# EAGLE design ruralhack-board-r2 (EAGLE 6.6.0)
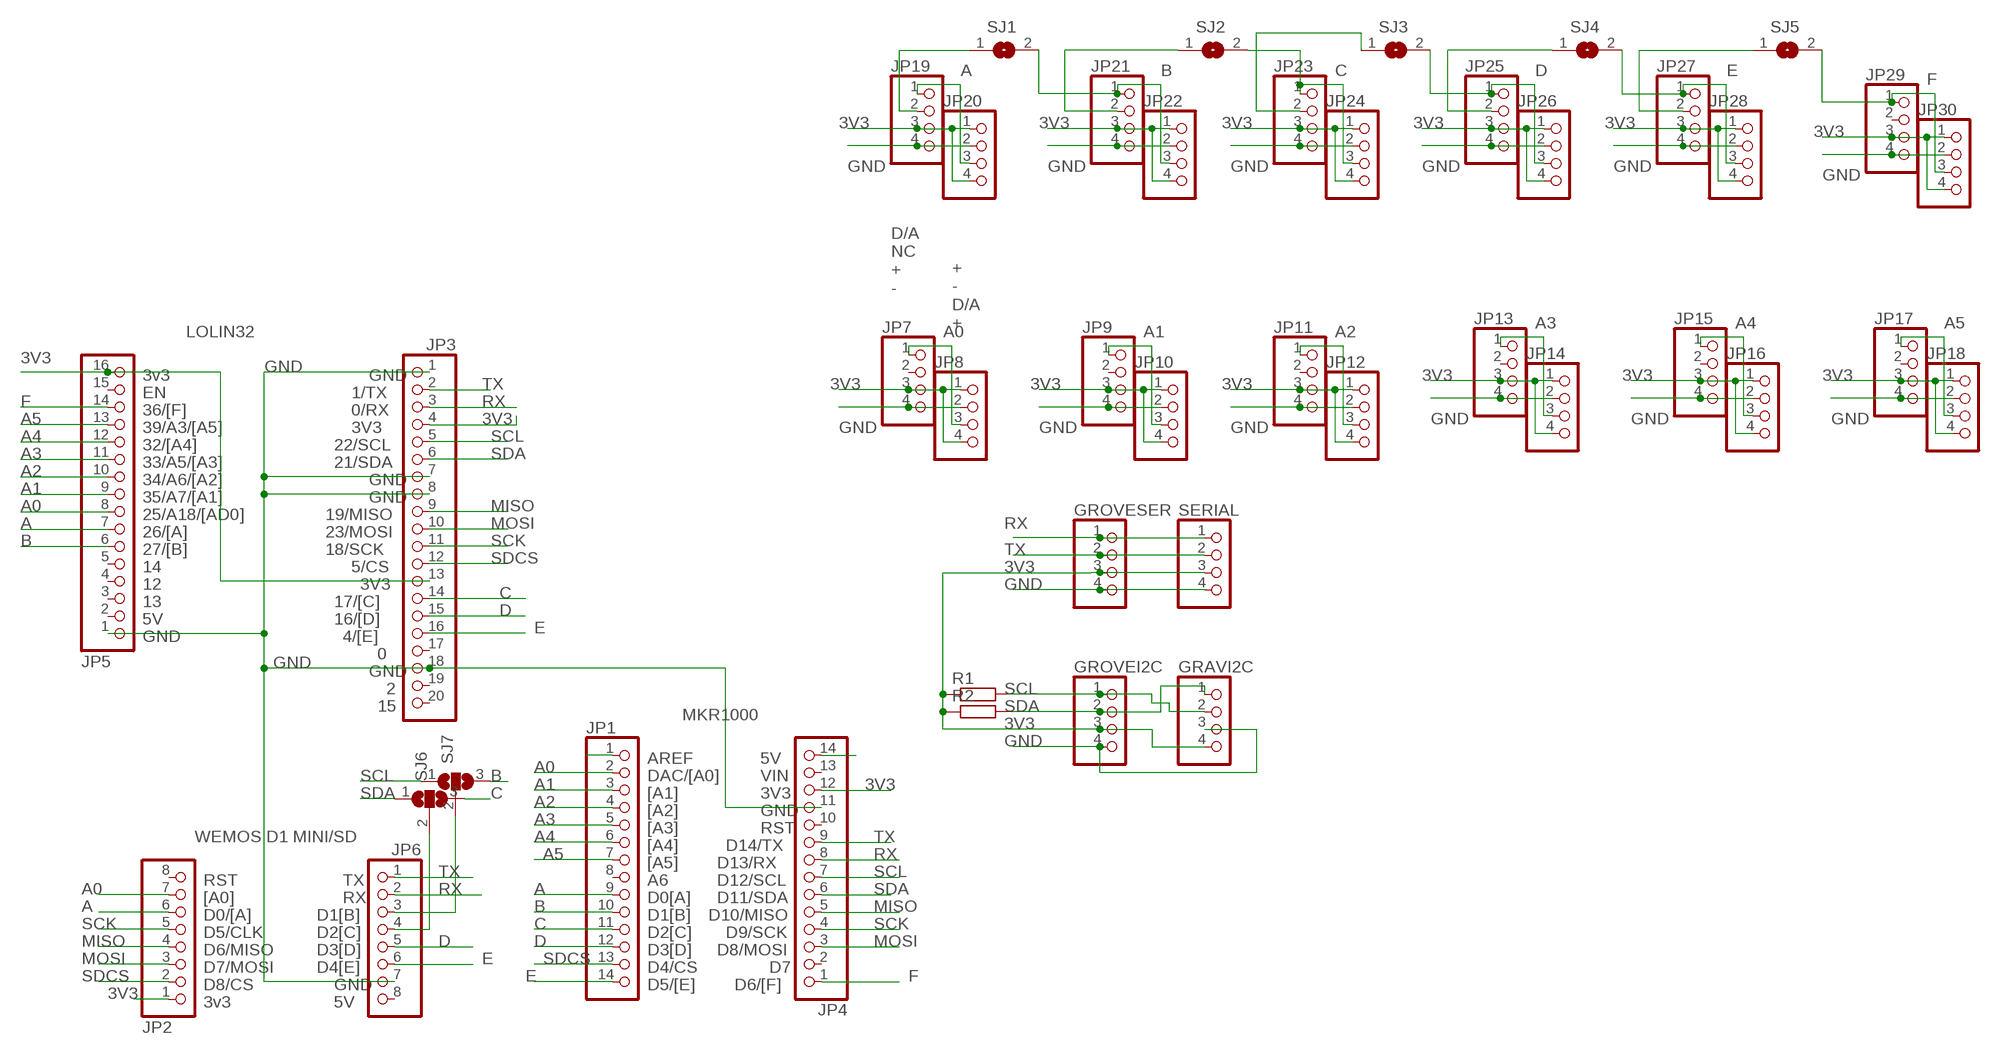
[diagram p0: schematic, sheet 1]

## Parts
GRAVI2C  PINHD-1X4  [1X04]
GROVEI2C  PINHD-1X4  [1X04]
GROVESER  PINHD-1X4  [1X04]
JP1  PINHD-1X14  [1X14]
JP2  PINHD-1X8  [1X08]
JP3  PINHD-1X20  [1X20]
JP4  PINHD-1X14  [1X14]
JP5  PINHD-1X16  [1X16]
JP6  PINHD-1X8  [1X08]
JP7  PINHD-1X4  [1X04]
JP8  PINHD-1X4  [1X04]
JP9  PINHD-1X4  [1X04]
JP10  PINHD-1X4  [1X04]
JP11  PINHD-1X4  [1X04]
JP12  PINHD-1X4  [1X04]
JP13  PINHD-1X4  [1X04]
JP14  PINHD-1X4  [1X04]
JP15  PINHD-1X4  [1X04]
JP16  PINHD-1X4  [1X04]
JP17  PINHD-1X4  [1X04]
JP18  PINHD-1X4  [1X04]
JP19  PINHD-1X4  [1X04]
JP20  PINHD-1X4  [1X04]
JP21  PINHD-1X4  [1X04]
JP22  PINHD-1X4  [1X04]
JP23  PINHD-1X4  [1X04]
JP24  PINHD-1X4  [1X04]
JP25  PINHD-1X4  [1X04]
JP26  PINHD-1X4  [1X04]
JP27  PINHD-1X4  [1X04]
JP28  PINHD-1X4  [1X04]
JP29  PINHD-1X4  [1X04]
JP30  PINHD-1X4  [1X04]
R1  R-EU_0204/7  [0204/7]
R2  R-EU_0204/7  [0204/7]
SERIAL  PINHD-1X4  [1X04]
SJ1  SJW  [SJW]
SJ2  SJW  [SJW]
SJ3  SJW  [SJW]
SJ4  SJW  [SJW]
SJ5  SJW  [SJW]
SJ6  SJ2WW  [SJ_2W]
SJ7  SJ2WW  [SJ_2W]

## Nets
3V3: GRAVI2C.4 GROVEI2C.3 GROVESER.3 JP2.1 JP3.4 JP3.13 JP4.12 JP5.16 JP7.3 JP8.1 JP8.4 JP9.3 JP10.1 JP10.4 JP11.3 JP12.1 JP12.4 JP13.3 JP14.1 JP14.4 JP15.3 JP16.1 JP16.4 JP17.3 JP18.1 JP18.4 JP19.3 JP20.1 JP20.4 JP21.3 JP22.1 JP22.4 JP23.3 JP24.1 JP24.4 JP25.3 JP26.1 JP26.4 JP27.3 JP28.1 JP28.4 JP29.3 JP30.1 JP30.4 R1.1 R2.1 SERIAL.3
A: JP1.9 JP2.6 JP5.7 JP19.1 JP20.3
A0: JP1.2 JP2.7 JP5.8 JP7.1 JP8.3
A1: JP1.3 JP5.9 JP9.1 JP10.3
A2: JP1.4 JP5.10 JP11.1 JP12.3
A3: JP1.5 JP5.11 JP13.1 JP14.3
A4: JP1.6 JP5.12 JP15.1 JP16.3
A5: JP1.7 JP5.13 JP17.1 JP18.3
B: JP1.10 JP5.6 JP21.1 JP22.3 SJ1.2 SJ7.3
C: JP1.11 JP3.14 JP23.1 JP24.3 SJ2.2 SJ6.3
D: JP1.12 JP3.15 JP6.5 JP25.1 JP26.3 SJ3.2
E: JP1.14 JP3.16 JP6.6 JP27.1 JP28.3 SJ4.2
F: JP4.1 JP5.14 JP29.1 JP30.3 SJ5.2
GND: GRAVI2C.3 GROVEI2C.4 GROVESER.4 JP3.1 JP3.7 JP3.8 JP3.18 JP4.11 JP5.1 JP6.7 JP7.4 JP8.2 JP9.4 JP10.2 JP11.4 JP12.2 JP13.4 JP14.2 JP15.4 JP16.2 JP17.4 JP18.2 JP19.4 JP20.2 JP21.4 JP22.2 JP23.4 JP24.2 JP25.4 JP26.2 JP27.4 JP28.2 JP29.4 JP30.2 SERIAL.4
MISO: JP2.4 JP3.9 JP4.5
MOSI: JP2.3 JP3.10 JP4.3
N$2: JP1.1
N$3: JP4.14
N$4: JP19.2 SJ1.1
N$6: JP21.2 SJ2.1
N$7: JP23.2 SJ3.1
N$8: JP25.2 SJ4.1
N$9: JP6.3 SJ7.2
N$10: JP27.2 SJ5.1
N$11: JP6.4 SJ6.2
RX: GROVESER.1 JP3.3 JP4.8 JP6.2 SERIAL.1
SCK: JP2.5 JP3.11 JP4.4
SCL: GRAVI2C.2 GROVEI2C.1 JP3.5 JP4.7 R1.2 SJ7.1
SDA: GRAVI2C.1 GROVEI2C.2 JP3.6 JP4.6 R2.2 SJ6.1
SDCS: JP1.13 JP2.2 JP3.12
TX: GROVESER.2 JP3.2 JP4.9 JP6.1 SERIAL.2
Unconnected: JP1.8 JP2.8 JP3.17 JP3.19 JP3.20 JP4.2 JP4.10 JP4.13 JP5.2 JP5.3 JP5.4 JP5.5 JP5.15 JP6.8 JP7.2 JP9.2 JP11.2 JP13.2 JP15.2 JP17.2 JP29.2

## Notes on the sheet
- D/A
  NC
  +
  -
- +
  -
  D/A
  +
- LOLIN32
- 3v3 | GND
- EN | 1/TX
- 36/[F] | 0/RX
- 39/A3/[A5] | 3V3
- 32/[A4] | 22/SCL
- 33/A5/[A3] | 21/SDA
- 34/A6/[A2] | GND
- 35/A7/[A1] | GND
- 25/A18/[AD0] | 19/MISO
- 26/[A] | 23/MOSI
- 27/[B] | 18/SCK
- 14 | 5/CS
- 12 | 3V3
- 13 | 17/[C]
- 5V | 16/[D]
- GND | 4/[E]
- 0
- GND
- 2
- 15
- MKR1000
- AREF | 5V
- DAC/[A0] | VIN
- [A1] | 3V3
- [A2] | GND
- [A3] | RST
- WEMOS D1 MINI/SD
- [A4] | D14/TX
- [A5] | D13/RX
- RST | TX | A6 | D12/SCL
- [A0] | RX | D0[A] | D11/SDA
- D0/[A] | D1[B] | D1[B] | D10/MISO
- D5/CLK | D2[C] | D2[C] | D9/SCK
- D6/MISO | D3[D] | D3[D] | D8/MOSI
- D7/MOSI | D4[E] | D4/CS | D7
- D8/CS | GND | D5/[E] | D6/[F]
- 3v3 | 5V

## Library data of the parts
GRAVI2C GROVEI2C GROVESER JP7-JP30 SERIAL = RepRapjr:PINHD-1X4: PIN HEADER
JP1 JP4 = pinhead-thin:PINHD-1X14: PIN HEADER
JP2 JP6 = pinhead-thin:PINHD-1X8: PIN HEADER
JP3 = pinhead-thin:PINHD-1X20: PIN HEADER
JP5 = pinhead-thin:PINHD-1X16: PIN HEADER
R1 R2 = rcl:R-EU_: RESISTOR, European symbol
SJ1-SJ5 = jumper:SJ: SMD solder JUMPER
SJ6 SJ7 = jumper:SJ2W: SMD solder JUMPER

## Board
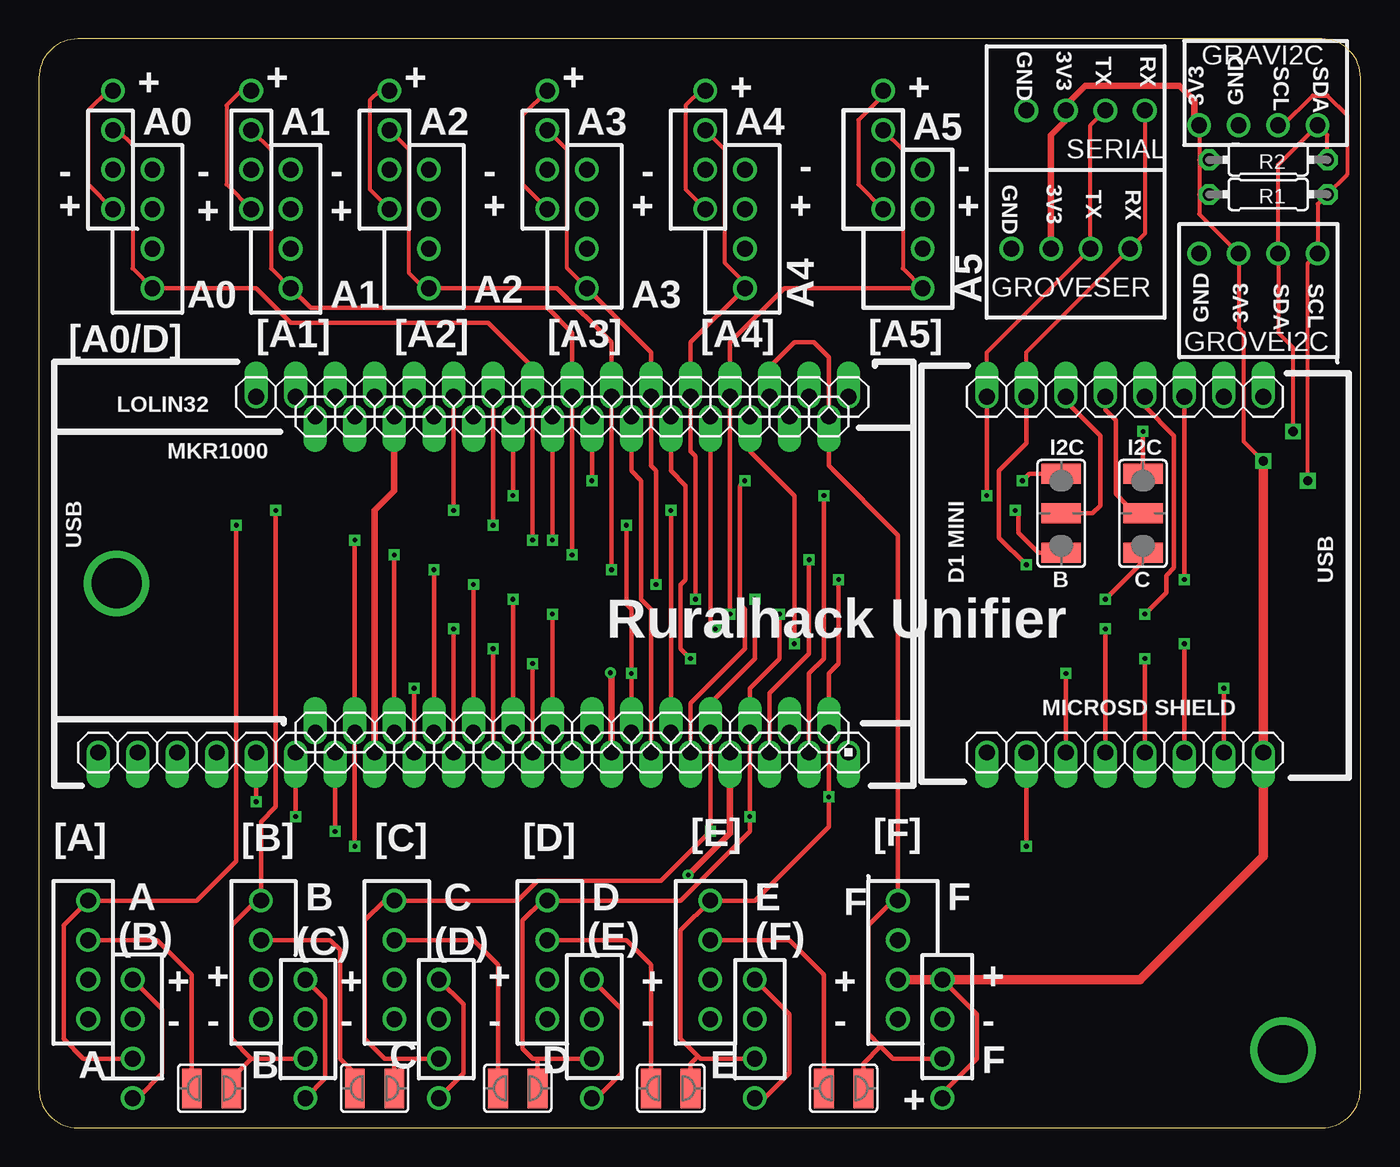
[diagram p1: board, top side]
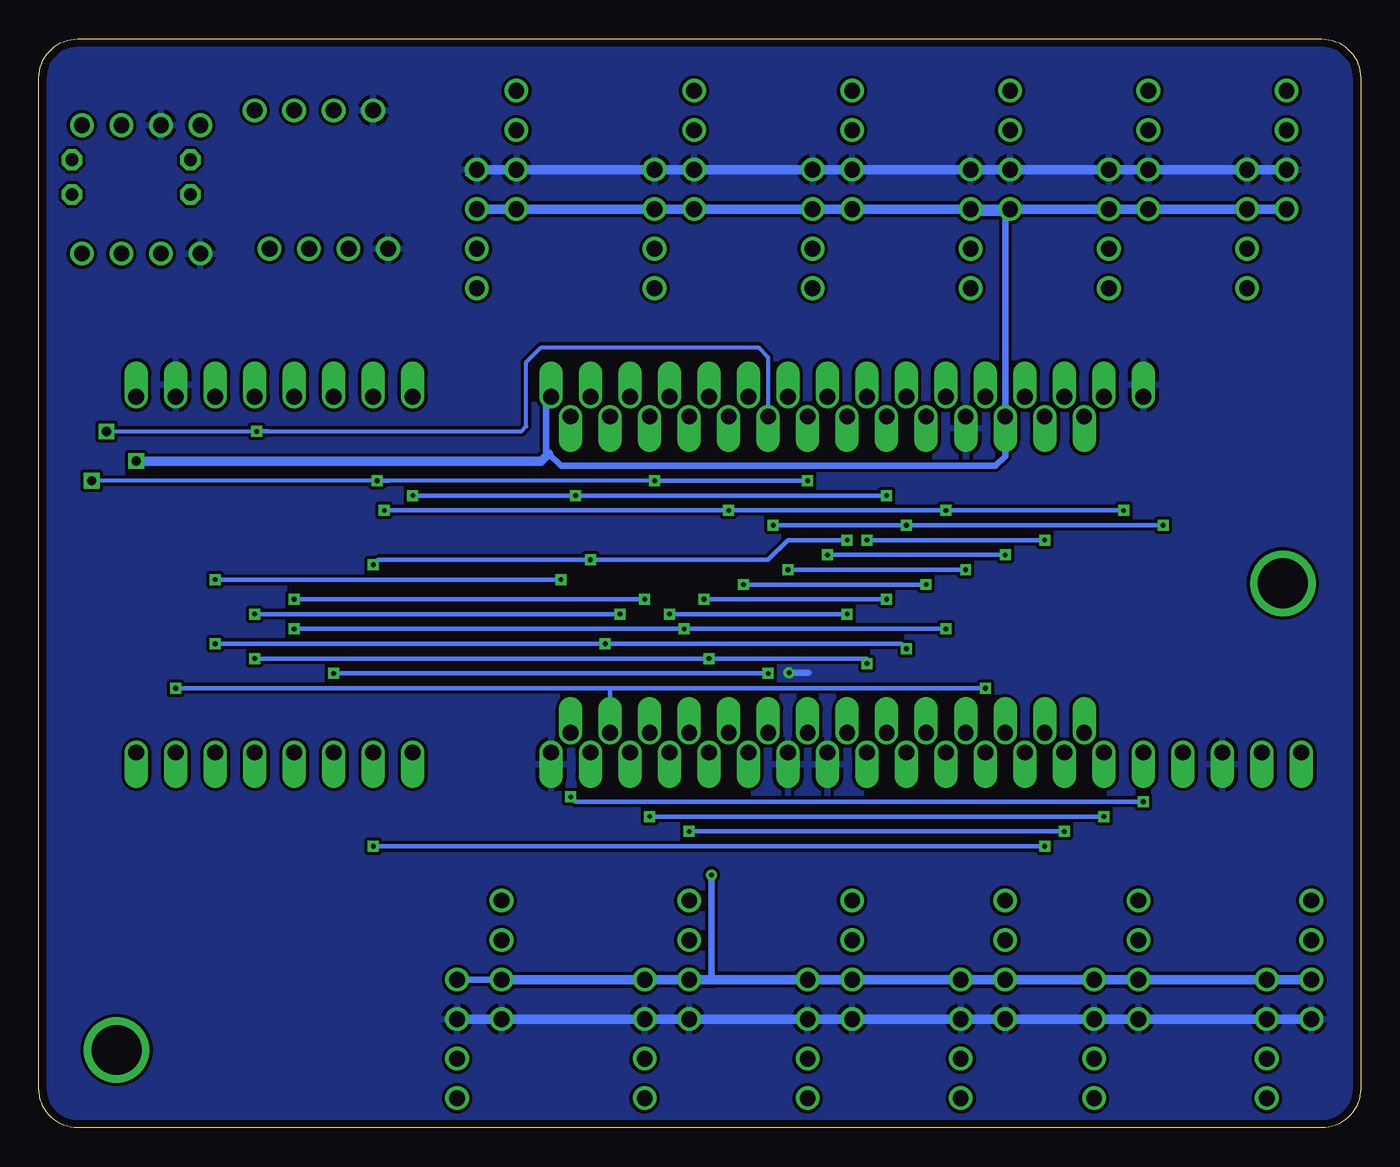
[diagram p2: board, bottom side, seen from below]

Size 85 x 70 mm. Coordinates in mm from the lower left corner, seen from the top.
Outline: 0,67.5 0,2.5 arc90 2.5,0 82.5,0 arc90 85,2.5 85,67.5 arc90 82.5,70 2.5,70 arc90 0,67.5
Copper layers (1*16): Top 0.035mm / dielectric 1.5mm / Bottom 0.035mm
Design rules "default *": minimum track width 10mil, minimum drill 0.3mm, track to track 8mil, track to pad 8mil, pad to pad 8mil, via to via 8mil, smd to smd 8mil, copper to edge 0.5mm, drill to drill 8mil, minimum pad ring 10mil, minimum via ring 8mil, stop-mask expansion 4mil, vias tented up to drill 0mil, thermal gap 10mil

### Footprints (pad centres in the part's own frame; a part is rotated, then mirrored left to right if it is on the bottom)
1X04 = drill 1.016: 1 -2.54,0; 2 0,0; 3 2.54,0; 4 5.08,0
1X14 = drill 1.016 offset: 1 -16.51,0; 2 -13.97,0; 3 -11.43,0; 4 -8.89,0; 5 -6.35,0; 6 -3.81,0; 7 -1.27,0; 8 1.27,0; 9 3.81,0; 10 6.35,0; 11 8.89,0; 12 11.43,0; 13 13.97,0; 14 16.51,0
1X08 = drill 1.016 offset: 1 -8.89,0; 2 -6.35,0; 3 -3.81,0; 4 -1.27,0; 5 1.27,0; 6 3.81,0; 7 6.35,0; 8 8.89,0
1X20 = drill 1.016 offset: 1 -24.13,0; 2 -21.59,0; 3 -19.05,0; 4 -16.51,0; 5 -13.97,0; 6 -11.43,0; 7 -8.89,0; 8 -6.35,0; 9 -3.81,0; 10 -1.27,0; 11 1.27,0; 12 3.81,0; 13 6.35,0; 14 8.89,0; 15 11.43,0; 16 13.97,0; 17 16.51,0; 18 19.05,0; 19 21.59,0; 20 24.13,0
1X16 = drill 1.016 offset: 1 -19.05,0; 2 -16.51,0; 3 -13.97,0; 4 -11.43,0; 5 -8.89,0; 6 -6.35,0; 7 -3.81,0; 8 -1.27,0; 9 1.27,0; 10 3.81,0; 11 6.35,0; 12 8.89,0; 13 11.43,0; 14 13.97,0; 15 16.51,0; 16 19.05,0
0204/7 = drill 0.813 octagon: 1 -3.81,0; 2 3.81,0
SJW = smd 1.27 x 2.54: 1 -1.27,0; 2 1.27,0
SJ_2W = smd 1.27 x 2.54: 1 -2.54,0; 2 0,0; 3 2.54,0

### Placement (x,y rotation side)
GRAVI2C  79.69,64.45 180 top
GROVEI2C  79.69,56.2 180 top
GROVESER  67.63,56.52 180 top
JP1  34.29,25.4 0 top
JP2  69.85,24.13 180 top
JP3  27.94,24.13 180 top
JP4  34.29,45.72 180 top
JP5  33.02,46.99 0 top
JP6  69.85,46.99 0 top
JP7  7.3,56.52 90 top
JP8  4.76,61.59 90 top
JP9  16.19,56.52 90 top
JP10  13.65,61.59 90 top
JP11  25.08,56.52 90 top
JP12  22.54,61.59 90 top
JP13  35.24,56.52 90 top
JP14  32.7,61.59 90 top
JP15  45.4,56.52 90 top
JP16  42.86,61.59 90 top
JP17  56.83,56.52 90 top
JP18  54.29,61.59 90 top
JP19  3.17,12.06 270 top
JP20  6.03,6.99 270 top
JP21  14.29,12.06 270 top
JP22  17.14,6.99 270 top
JP23  22.86,12.06 270 top
JP24  25.72,6.99 270 top
JP25  32.7,12.06 270 top
JP26  35.56,6.99 270 top
JP27  43.18,12.06 270 top
JP28  46.04,6.99 270 top
JP29  55.24,12.06 270 top
JP30  58.1,6.99 270 top
R1  79.06,60.01 0 top
R2  79.06,62.23 0 top
SERIAL  68.58,65.41 180 top
SJ1  11.11,2.54 0 top
SJ2  21.59,2.54 0 top
SJ3  30.8,2.54 0 top
SJ4  40.64,2.54 0 top
SJ5  51.75,2.54 0 top
SJ6  71,39.5 270 top
SJ7  65.75,39.5 270 top

### Tracks (layer width: path | path; a pad name or v marks a point on that pad's centre or on a via)
3V3  (via drill 0.3, 0.6)
  Top 0.254: JP14.4 31.11,65.09 31.11,60.64 JP14.1 | JP16.4 42.55,66.67 41.59,65.72 41.59,60.33 JP16.1 | JP18.4 54.29,66.36 52.7,64.77 52.7,60.64 JP18.1 | JP12.4 21.91,66.67 21.27,66.04 21.27,60.33 JP12.1 | JP10.4 13.02,66.67 12.06,65.72 12.06,60.64 JP10.1 | JP8.4 4.45,66.67 3.17,65.41 3.17,60.64 JP8.1 | GRAVI2C.4 74.61,62.23 | 74.61,62.23 74.61,60.01 | 74.61,60.01 74.61,58.74 GROVEI2C.3 77.15,51.44 77.47,51.12 77.47,44.13 v78.74,42.86 | R1.1 74.61,60.01 | R2.1 74.61,62.23
  Top 0.305: JP20.4 6.35,1.91 7.94,3.49 7.94,7.62 JP20.1 | JP22.4 18.41,3.17 18.41,8.26 JP22.1 | JP24.4 27.3,3.49 27.3,7.94 JP24.1 | JP26.4 35.88,1.91 37.47,3.49 37.47,7.62 JP26.1 | JP28.4 46.67,1.91 48.26,3.49 48.26,7.3 JP28.1 | JP30.4 58.1,2.22 60.33,4.45 60.33,7.3 JP30.1
  Top 0.406: JP3.13 21.59,39.69 22.86,40.96 JP4.12 | GROVESER.3 65.09,63.82 66.04,64.77 SERIAL.3 66.04,65.72 67.31,66.99 73.34,66.99 74.3,66.04 74.3,64.77 GRAVI2C.4 | JP3.4 44.45,18.95 v41.75,16.25
  Top 0.61: v78.74,42.86 JP2.1 78.74,17.46 70.8,9.53 JP29.3
  Bottom 0.254: 22.86,58.74 24.77,58.74 JP11.3 JP13.3 35.56,58.74
  Bottom 0.406: JP12.1 22.86,58.74 JP4.12 22.86,43.18 23.5,42.55 51.44,42.55 52.23,43.34 52.39,43.5 52.39,46.67 JP5.16 | JP29.3 JP30.1 | v41.75,16.25 41.75,9.78 41.5,9.53
  Bottom 0.61: JP29.3 JP28.1 JP27.3 41.5,9.53 JP26.1 JP25.3 JP24.1 JP23.3 JP22.1 JP21.3 JP20.1 JP19.3 | JP8.1 JP7.3 JP10.1 JP9.3 JP12.1 JP11.3 JP14.1 JP13.3 JP16.1 JP15.3 JP18.1 JP17.3 | v78.74,42.86 52.7,42.86 52.23,43.34
A  (via drill 0.3)
  Top 0.305: JP1.9 v38.1,29.21 38.1,33.34 37.78,33.66 v37.78,38.73 | v29.21,38.73 JP5.7 | JP2.6 v66.04,29.21 | v12.7,38.73 12.7,17.14 10.16,14.61 JP19.1 1.59,13.02 1.59,5.71 2.86,4.45 JP20.3
  Bottom 0.305: v37.78,38.73 v29.21,38.73 v12.7,38.73 | v66.04,29.21 v38.1,29.21
A0  (via drill 0.3)
  Top 0.254: JP8.3 5.08,64.14 6.03,63.18 6.03,55.24 JP7.1
  Top 0.305: v20.32,37.78 JP1.2 v20.32,18.1 | v31.75,37.78 JP5.8 31.75,48.9 28.89,51.75 16.19,51.75 13.97,53.98 JP7.1 | JP2.7 v63.5,18.1
  Bottom 0.305: v20.32,37.78 v31.75,37.78 | v63.5,18.1 v20.32,18.1
A1  (via drill 0.3)
  Top 0.254: JP10.3 14.92,62.87 14.92,55.24 JP9.1
  Top 0.305: v34.29,36.83 JP5.9 34.29,51.12 32.7,52.7 17.46,52.7 JP9.1 | v22.86,36.83 JP1.3
  Bottom 0.305: v34.29,36.83 v22.86,36.83
A2  (via drill 0.3)
  Top 0.254: JP11.1 24.77,53.98 23.81,54.93 23.81,62.87 JP12.3
  Top 0.305: JP1.4 v25.4,35.88 | v36.83,35.88 JP5.10 36.83,50.48 33.34,53.98 JP11.1
  Bottom 0.305: v25.4,35.88 v36.83,35.88
A3  (via drill 0.3)
  Top 0.254: JP13.1 33.97,55.24 33.97,62.87 JP14.3
  Top 0.305: JP1.5 v27.94,34.92 | v39.69,34.92 39.69,42.23 39.37,42.55 JP5.11 39.37,49.85 JP13.1
  Bottom 0.305: v27.94,34.92 v39.69,34.92
A4  (via drill 0.3)
  Top 0.254: JP15.1 45.4,54.29 44.13,55.56 44.13,62.87 JP16.3
  Top 0.305: JP1.6 v30.48,33.97 | v42.23,33.97 42.23,43.18 41.91,43.5 JP5.12 41.91,50.48 JP15.1
  Bottom 0.305: v30.48,33.97 v42.23,33.97
A5  (via drill 0.3)
  Top 0.254: JP18.3 55.56,62.87 55.56,55.24 JP17.1
  Top 0.305: JP1.7 v33.02,33.02 | v44.45,33.02 JP5.13 44.45,50.48 47.94,53.98 JP17.1
  Bottom 0.305: v33.02,33.02 v44.45,33.02
B  (via drill 0.3)
  Top 0.305: JP5.6 v26.67,39.69 | v40.64,39.69 JP1.10 | v15.24,39.69 15.24,20.64 14.29,19.68 JP21.1 13.97,14.61 12.38,13.02 12.38,5.71 13.65,4.45 | 13.65,4.45 JP22.3 | SJ1.2 12.38,3.17 13.65,4.45 | SJ7.3 64.29,36.96 63,38.25 63,39.48 v62.79,39.69
  Bottom 0.305: v62.79,39.69 v40.64,39.69 v26.67,39.69 v15.24,39.69
C  (via drill 0.3)
  Top 0.305: v46.04,33.97 46.04,30.16 43.18,27.3 JP1.11 v43.18,19.05 40.01,15.88 32.07,15.88 30.8,14.61 JP23.1 22.23,14.61 20.95,13.34 20.95,5.71 22.23,4.45 22.86,4.45 | JP3.14 v19.05,19.05 | 22.86,4.45 JP24.3 | SJ2.2 22.86,4.45 | SJ6.3 71,36.39 v68.58,33.97
  Bottom 0.305: v68.58,33.97 v46.04,33.97 | v19.05,19.05 v43.18,19.05
D  (via drill 0.3)
  Top 0.305: v47.62,33.02 47.62,30.16 45.72,28.26 JP1.12 v45.72,20 45.72,19.05 41.27,14.61 JP25.1 32.38,14.61 31.11,13.34 31.11,5.08 31.75,4.45 32.07,4.45 | JP3.15 v16.51,20 | 32.07,4.45 JP26.3 | SJ3.2 32.07,4.45 | JP6.5 71.12,46.38 73,44.5 73,36 72.5,35.5 72.5,34.4 v71.12,33.02
  Bottom 0.305: v47.62,33.02 v71.12,33.02 | v16.51,20 v45.72,20
E  (via drill 0.3)
  Top 0.305: JP3.16 v13.97,20.95 | JP6.6 v73.66,35.24 | v51.44,35.24 51.44,29.84 50.8,29.21 JP1.14 v50.8,21.27 50.8,19.37 46.04,14.61 JP27.1 41.27,12.7 41.27,5.71 42.39,4.6 | JP28.3 42.55,4.45 42.39,4.6 | SJ4.2 41.91,4.13 42.39,4.6
  Bottom 0.305: v13.97,20.95 50.48,20.95 v50.8,21.27 | v73.66,35.24 v51.44,35.24
F
  Top 0.305: JP5.14 46.99,48.9 48.58,50.48 49.85,50.48 50.8,49.53 JP4.1 50.8,42.55 55.24,38.1 JP29.1 54.93,14.61 53.34,13.02 53.34,6.03 54.13,5.24 | 54.13,5.24 54.93,4.45 JP30.3 | SJ5.2 53.02,4.13 54.13,5.24
GND  (via drill 0.3)
  Top 0.406: JP3.7 36.83,29.17 v36.75,29.25
  Bottom 0.254: JP17.4 57.15,61.59 57.47,61.28 57.15,61.28 JP17.4
  Bottom 0.406: v36.75,29.25 35.5,29.25
  Bottom 0.61: JP28.2 JP29.4 JP30.2 JP28.2 | JP19.4 JP20.2 JP21.4 JP22.2 JP23.4 JP24.2 JP26.2 JP27.4 JP28.2 | JP8.2 JP7.4 JP10.2 JP9.4 JP12.2 JP11.4 JP14.2 JP13.4 JP16.2 JP15.4 JP18.2 JP17.4
  pour Bottom: -10,75 92.5,75 arc-90 95,72.5 95,0 95,-5 -10,-5
MISO  (via drill 0.3)
  Top 0.305: JP4.5 40.64,42.23 41.59,41.27 41.59,35.24 41.27,34.92 41.27,30.8 v41.91,30.16 | v71.12,30.16 JP2.4 | JP3.9 v31.75,29.84
  Bottom 0.305: v71.12,30.16 v41.91,30.16 31.75,30.16 v31.75,29.84
MOSI  (via drill 0.3)
  Top 0.305: JP3.10 v29.21,30.8 | v73.66,31.11 JP2.3 | JP4.3 45.72,43.5 48.58,40.64 v48.58,31.11
  Bottom 0.305: v29.21,30.8 29.53,31.11 v48.58,31.11 v73.66,31.11
N$1  (via drill 3.2)
  other vias: 5,35
N$4
  Top 0.305: SJ1.1 9.84,9.84 7.62,12.06 JP19.2
N$5  (via drill 3.2)
  other vias: 80,5
N$6
  Top 0.305: SJ2.1 20.32,3.49 19.37,4.45 19.37,11.43 18.73,12.06 JP21.2
N$7
  Top 0.305: SJ3.1 29.53,10.48 27.94,12.06 JP23.2
N$8
  Top 0.305: SJ4.1 39.37,10.48 37.78,12.06 JP25.2
N$9
  Top 0.305: JP6.3 66.04,46.71 68.25,44.5 68.25,40 67.75,39.5 SJ7.2
N$10
  Top 0.305: SJ5.1 50.48,9.84 48.26,12.06 JP27.2
N$11
  Top 0.305: JP6.4 68.58,46.17 69.25,45.5 69.25,40.75 70,40 70.5,40 SJ6.2
RX  (via drill 0.3)
  Top 0.254: SERIAL.1 71.12,57.47 GROVESER.1 63.5,49.85 JP6.2
  Top 0.305: JP3.3 46.99,27.94 49.53,30.48 v49.53,36.51 | v33.02,37.78 JP4.8 | JP6.2 63.5,44 61.75,42.25 61.75,37.95 v63.5,36.2
  Bottom 0.305: v63.5,36.2 63.18,36.51 v49.53,36.51 38.1,36.51 36.83,37.78 v33.02,37.78
SCK  (via drill 0.3)
  Top 0.305: JP3.11 v26.67,32.07 | v68.58,32.07 JP2.5 | JP4.4 43.18,32.38 v43.5,32.07
  Bottom 0.305: v26.67,32.07 v43.5,32.07 v68.58,32.07
SCL  (via drill 0.3, 0.6)
  Top 0.254: GRAVI2C.2 80.01,64.45 81.92,66.36 82.87,66.36 84.14,65.09 84.14,61.28 R1.2 82.23,59.37 GROVEI2C.1 81.6,55.56 v81.6,41.59
  Top 0.305: JP3.5 41.91,27.3 45.4,30.8 45.4,33.34 45.09,33.66 45.09,41.27 v45.4,41.59 | v35.56,41.59 JP4.7 | SJ7.1 63.7,42.04 v63.25,41.59
  Bottom 0.254: v45.4,41.59 62.5,41.59 | v63.25,41.59 v81.6,41.59
  Bottom 0.305: v45.4,41.59 v35.56,41.59 | v63.25,41.59 62.5,41.59
SDA  (via drill 0.3, 0.6)
  Top 0.254: v80.64,44.77 80.64,50.16 79.69,51.12 GROVEI2C.2 79.69,61.91 GRAVI2C.1 82.87,63.82 R2.2
  Top 0.305: JP3.6 39.37,33.34 38.73,33.97 38.73,41.59 38.1,42.23 JP4.6 | SJ6.1 v71,44.77
  Bottom 0.254: v80.64,44.77 v71,44.77 | 70.25,44.77 53.98,44.77 53.66,45.09 53.66,49.21 52.7,50.16 38.73,50.16 38.1,49.53 JP4.6
  Bottom 0.305: v71,44.77 70.25,44.77
SDCS  (via drill 0.3)
  Top 0.305: JP3.12 v24.13,28.26 | v76.2,28.26 JP2.2
  Bottom 0.305: v24.13,28.26 48.26,28.26 | 48.26,28.26 v76.2,28.26 | JP1.13 48.26,28.26
TX  (via drill 0.3)
  Top 0.254: JP6.1 60.96,49.85 GROVESER.2 67.63,64.45 SERIAL.2
  Top 0.305: JP4.9 v30.48,40.64 | v60.96,40.64 JP6.1 | JP3.2 49.53,29.21 50.48,30.16 v50.48,40.64
  Bottom 0.305: v30.48,40.64 v50.48,40.64 v60.96,40.64

### Text on the board
tPlace: GND | 3V3 | TX | RX | SCL | SDA | + | + | + | + | + | + | 3V3 | GND | A0 | A1 | A2 | A3 | A4 | A5 | - | - | - | - | - | - | - | GND | 3V3 | TX | RX | + | + | + | + | + | + | + | SDA | SCL | A0 | A1 | A2 | A3 | A4 | A5 | GND | 3V3 | [A0/D] | [A1] | [A2] | [A3] | [A4] | [A5] | LOLIN32 | I2C | I2C | MKR1000 | USB | B | C | D1 MINI | USB | Ruralhack Unifier | MICROSD SHIELD | [A] | [B] | [C] | [D] | [E] | [F] | A | B | C | D | E | F | F | (B) | (C) | (D) | (E) | (F) | + | + | + | + | + | + | + | - | - | - | - | - | - | - | C | A | B | D | E | F | +